# EAGLE schematic ShutdownOverview_rev0 (EAGLE 8.6.3)

## Sheet 1 of 2
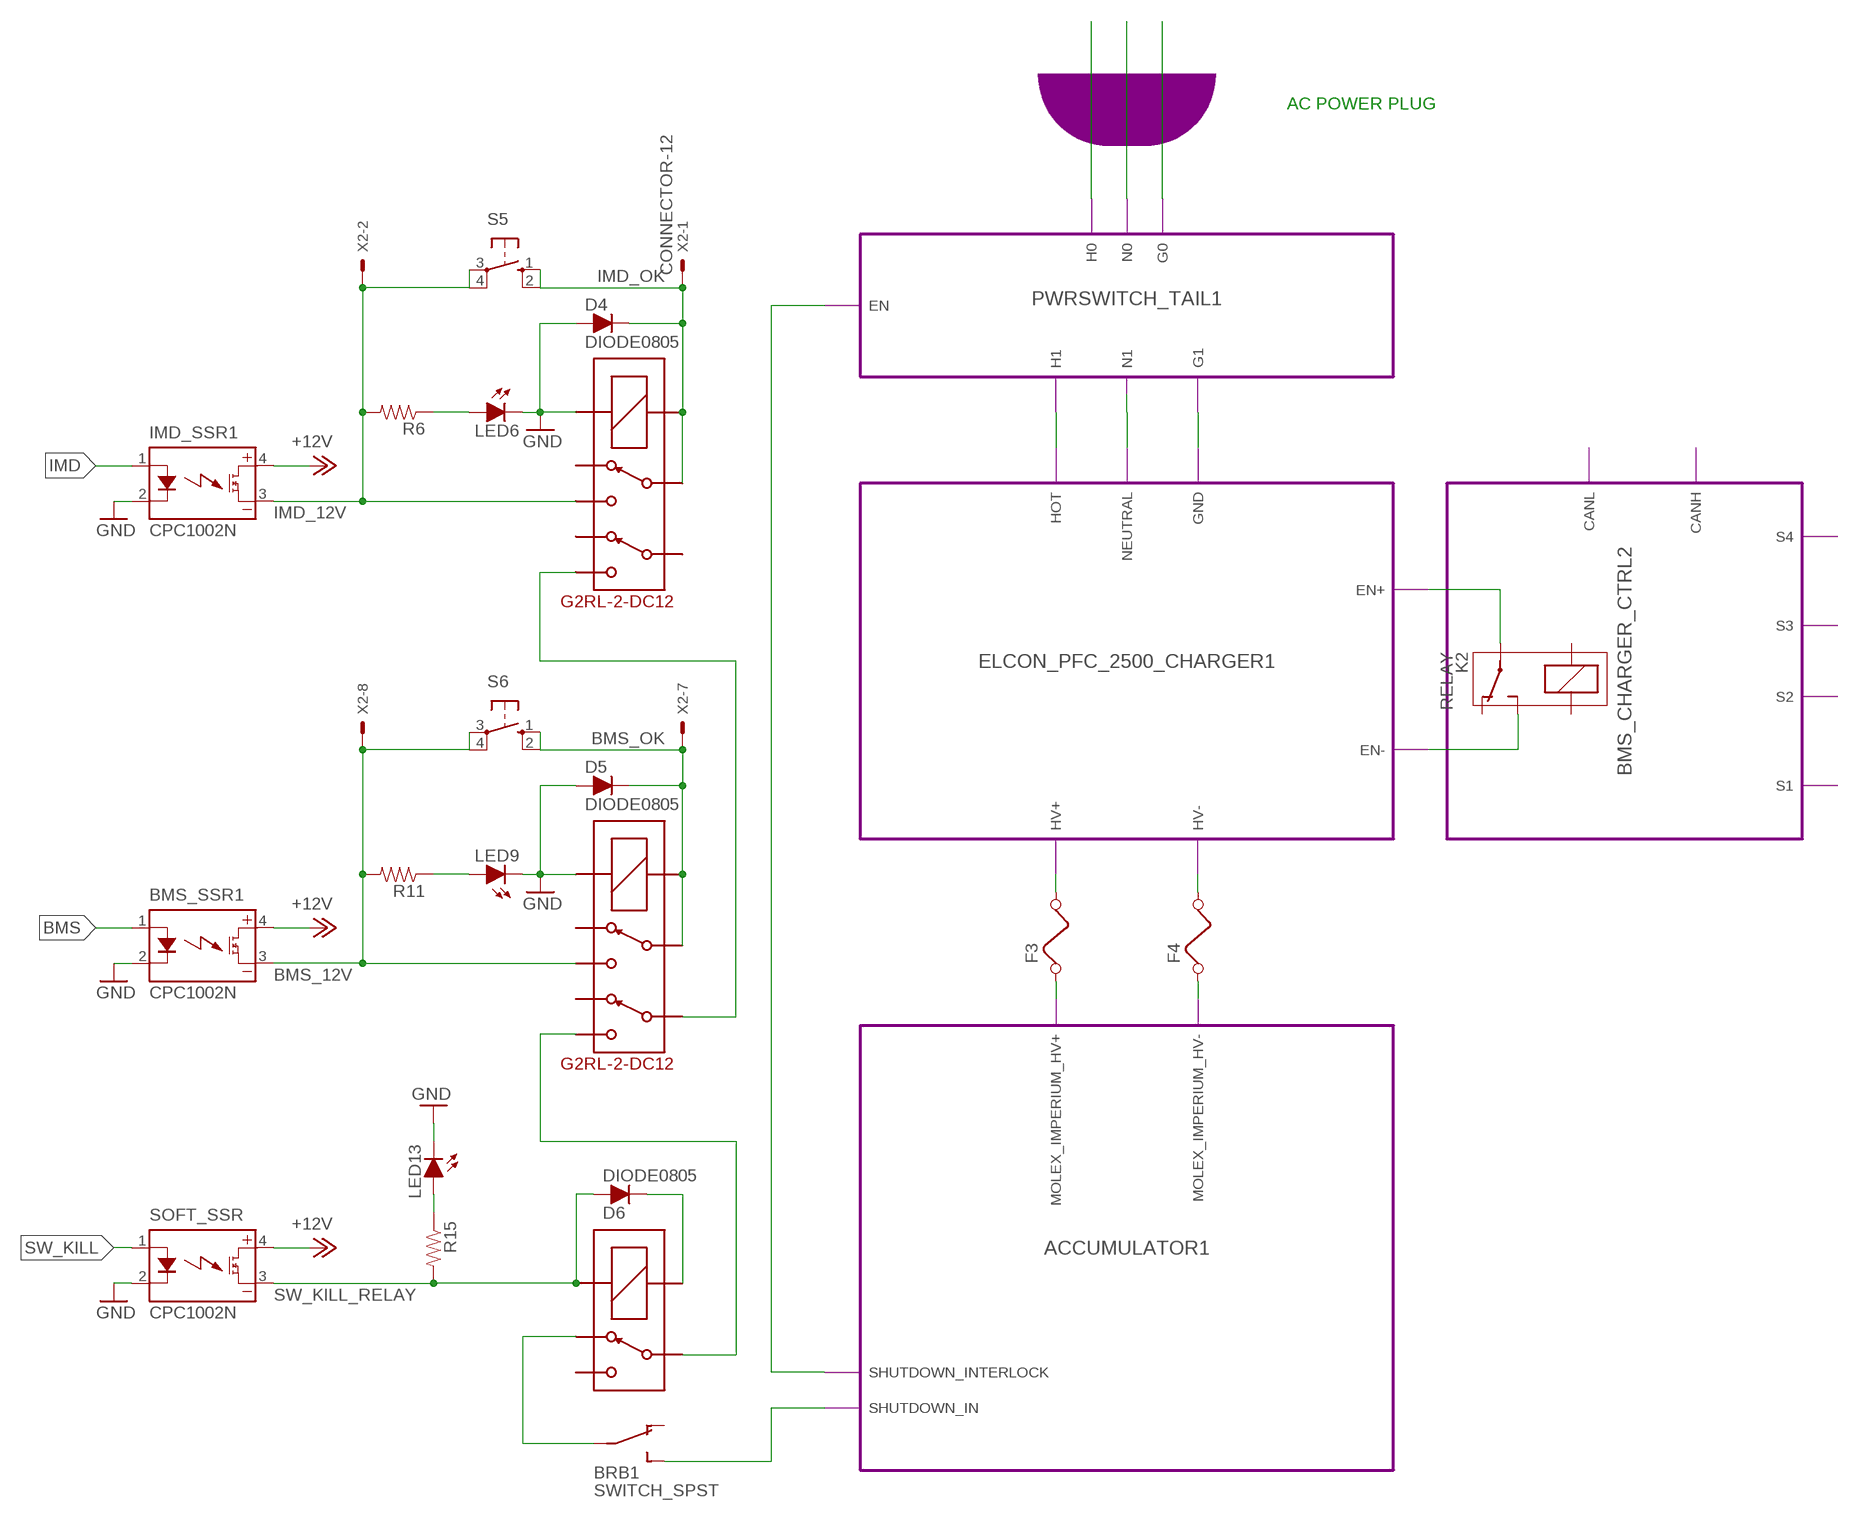
[diagram p0: schematic, sheet 1]

### Parts
BMS_SSR1  CPC1002N  [SOP04]
BRB1  SWITCH_SPST  (no package)
D4  DIODE0805  [0805_D]
D5  DIODE0805  [0805_D]
D6  DIODE0805  [0805_D]
F3  FUSE  [FUSE]
F4  FUSE  [FUSE]
IMD_SSR1  CPC1002N  [SOP04]
K2  RELAY  (no package)
LED6  LED-0805  [LED-805]
LED9  LED-0805  [LED-805]
LED13  LED-0805  [LED-805]
R6  RESISTOR0805-RES  [0805]
R11  RESISTOR0805-RES  [0805]
R15  RESISTOR0805-RES  [0805]
S5  BTN_10-XX  [B3F-10XX]
S6  BTN_10-XX  [B3F-10XX]
SOFT_SSR  CPC1002N  [SOP04]
U$6  G2RL-2-DC12  [G2RL-2]
U$7  G2RL-2-DC12  [G2RL-2]
U$8  G5LE  [ZF112]
X2  CONNECTOR-12  [MINIFIT_5566-12]

### Module instances
ACCUMULATOR1 = ACCUMULATOR
ELCON_PFC_2500_CHARGER1 = ELCON_PFC_2500_CHARGER
PWRSWITCH_TAIL1 = PWRSWITCH_TAIL
BMS_CHARGER_CTRL2 = BMS

### Nets
+12V: BMS_SSR1.4(DC+) IMD_SSR1.4(DC+) SOFT_SSR.4(DC+)
BMS: BMS_SSR1.1(CONTROL+)
BMS_12V: BMS_SSR1.3(DC-) R11.2 S6.3(P) S6.4(P1) U$7.4 X2.8
BMS_OK: D5.C S6.1(S) S6.2(S1) U$7.3 U$7.COIL- X2.7
GND: BMS_SSR1.2(CONTROL-) D4.A D5.A IMD_SSR1.2(CONTROL-) LED6.C LED9.C LED13.C SOFT_SSR.2(CONTROL-) U$6.COIL+ U$7.COIL+ ; also sheet 2
IMD: IMD_SSR1.1(CONTROL+)
IMD_12V: IMD_SSR1.3(DC-) R6.2 S5.3(P) S5.4(P1) U$6.4 X2.2
IMD_OK: D4.C S5.1(S) S5.2(S1) U$6.3 U$6.COIL- X2.1
N$1: U$6.5 U$7.6
N$2: U$7.5 U$8.P
N$3: port PWRSWITCH_TAIL1.H1 ELCON_PFC_2500_CHARGER1.HOT
N$4: port PWRSWITCH_TAIL1.N1 ELCON_PFC_2500_CHARGER1.NEUTRAL
N$5: port PWRSWITCH_TAIL1.G1 ELCON_PFC_2500_CHARGER1.GND
N$6: LED6.A R6.1
N$7: LED9.A R11.1
N$8: F3.2 ; port ELCON_PFC_2500_CHARGER1.HV+
N$9: F4.2 ; port ELCON_PFC_2500_CHARGER1.HV-
N$11: port ACCUMULATOR1.SHUTDOWN_INTERLOCK PWRSWITCH_TAIL1.EN
N$12: port PWRSWITCH_TAIL1.H0
N$13: port PWRSWITCH_TAIL1.N0
N$14: LED13.A R15.1
N$15: port PWRSWITCH_TAIL1.G0
N$19: F3.1
N$21: F4.1
N$26: K2.S ; port ELCON_PFC_2500_CHARGER1.EN-
N$27: K2.P ; port ELCON_PFC_2500_CHARGER1.EN+
N$28: BRB1.S ; port ACCUMULATOR1.SHUTDOWN_IN
N$29: D6.C U$8.2(COIL-)
N$30: U$8.O
SW_KILL: SOFT_SSR.1(CONTROL+)
SW_KILL_RELAY: D6.A R15.2 SOFT_SSR.3(DC-) U$8.1(COIL+)
Unconnected: BRB1.O BRB1.P K2.1 K2.2 K2.O U$6.2 U$6.6 U$6.7 U$7.2 U$7.7 U$8.S X2.3 X2.4 X2.5 X2.6 X2.9 X2.10 X2.11 X2.12

### Notes on the sheet
- AC POWER PLUG

## Sheet 2 of 2
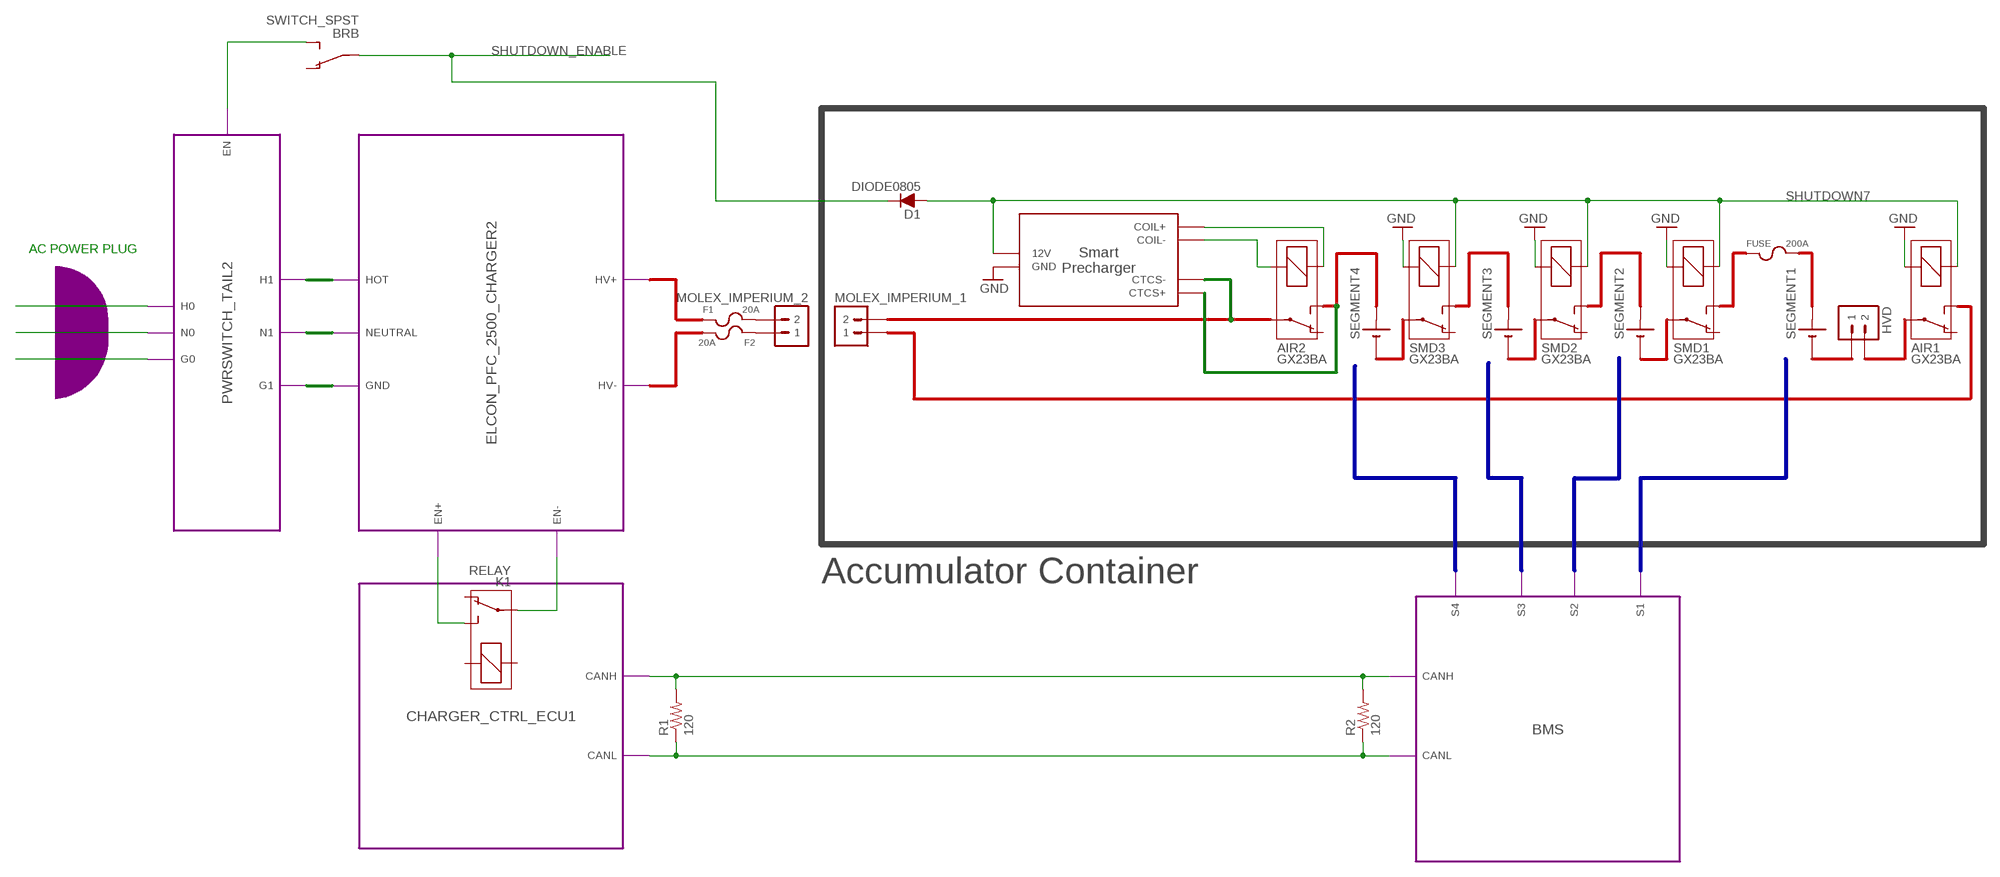
[diagram p1: schematic, sheet 2]

### Parts
AIR1  GX23BA  RELAY  (no package)
AIR2  GX23BA  RELAY  (no package)
BRB  SWITCH_SPST  (no package)
D1  DIODE0805  [0805_D]
F1  20A  FUSE  (no package)
F2  20A  FUSE  (no package)
FUSE  200A  FUSE  (no package)
HVD  M02  (no package)
K1  RELAY  (no package)
MOLEX_IMPERIUM_1  M02  (no package)
MOLEX_IMPERIUM_2  M02  (no package)
R1  120  RESISTORPTH-1/4W  [AXIAL-0.4]
R2  120  RESISTORPTH-1/4W  [AXIAL-0.4]
SEGMENT1  BATTERY_1_CELL  (no package)
SEGMENT2  BATTERY_1_CELL  (no package)
SEGMENT3  BATTERY_1_CELL  (no package)
SEGMENT4  BATTERY_1_CELL  (no package)
SMD1  GX23BA  RELAY  (no package)
SMD2  GX23BA  RELAY  (no package)
SMD3  GX23BA  RELAY  (no package)
U$3  SMART_PRECHARGER  (no package)

### Module instances
ELCON_PFC_2500_CHARGER2 = ELCON_PFC_2500_CHARGER
PWRSWITCH_TAIL2 = PWRSWITCH_TAIL
BMS = BMS
CHARGER_CTRL_ECU1 = CHARGER_CTRL_ECU

### Nets
GND: AIR1.2 SMD1.2 SMD2.2 SMD3.2 U$3.GND ; also sheet 1
N$10: BRB.S ; port PWRSWITCH_TAIL2.EN
N$16: port PWRSWITCH_TAIL2.H1 ELCON_PFC_2500_CHARGER2.HOT
N$17: port PWRSWITCH_TAIL2.N1 ELCON_PFC_2500_CHARGER2.NEUTRAL
N$18: port PWRSWITCH_TAIL2.G1 ELCON_PFC_2500_CHARGER2.GND
N$20: port PWRSWITCH_TAIL2.G0
N$22: port PWRSWITCH_TAIL2.N0
N$23: port PWRSWITCH_TAIL2.H0
N$24: K1.S ; port ELCON_PFC_2500_CHARGER2.EN+
N$25: K1.P ; port ELCON_PFC_2500_CHARGER2.EN-
N$31: F2.1 MOLEX_IMPERIUM_2.1
N$32: F1.2 MOLEX_IMPERIUM_2.2
N$37: R1.P$2 R2.P$2 ; port CHARGER_CTRL_ECU1.CANH BMS.CANH
N$38: R1.P$1 R2.P$1 ; port CHARGER_CTRL_ECU1.CANL BMS.CANL
N$42: U$3.CTCS-
N$45: AIR2.2 U$3.COIL-
N$54: AIR2.1 U$3.COIL+
N$60: U$3.CTCS+
SHUTDOWN7: AIR1.1 D1.A SMD1.1 SMD2.1 SMD3.1 U$3.12V
SHUTDOWN_ENABLE: BRB.P D1.C
Unconnected: AIR1.O AIR1.P AIR1.S AIR2.O AIR2.P AIR2.S BRB.O F1.1 F2.2 FUSE.1 FUSE.2 HVD.1 HVD.2 K1.1 K1.2 K1.O MOLEX_IMPERIUM_1.1 MOLEX_IMPERIUM_1.2 SEGMENT1.+ SEGMENT1.- SEGMENT2.+ SEGMENT2.- SEGMENT3.+ SEGMENT3.- SEGMENT4.+ SEGMENT4.- SMD1.O SMD1.P SMD1.S SMD2.O SMD2.P SMD2.S SMD3.O SMD3.P SMD3.S

### Buses
B$1
B$2
B$3
B$4

### Notes on the sheet
- AC POWER PLUG
- Accumulator Container

## Library data of the parts
AIR1 AIR2 K1 K2 SMD1-SMD3 = HyTechSymbols:RELAY: RELAY 1 x switch
BMS_SSR1 IMD_SSR1 SOFT_SSR = HyTechDevices:CPC1002N: IXYS Solid State Relay .7A
BRB BRB1 = HyTechSymbols:SWITCH_SPST: Single Pull Single Throw Switch
D1 D4-D6 = HyTechDevices:DIODE: DIODE general purpose rectifier
F1 F2 FUSE = HyTechSymbols:FUSE: Generic Fuse
F3 F4 = special:FUSE: FUSE 5 x 20 mm
HVD MOLEX_IMPERIUM_1 MOLEX_IMPERIUM_2 = HyTechSymbols:M02: Generic 2-pin connector
LED6 LED9 LED13 = HyTechDevices:LED: Light Emitting Diode (LED) Source: Dangerous Prototypes Eagle Library <https://github.com/DangerousPrototypes/Eagle_Part_Library>
R1 R2 R6 R11 R15 = HyTechDevices:RESISTOR: Resistor Basic schematic elements and footprints for 0603, 1206, and PTH resistors.
S5 S6 = HyTechDevices:BTN_10-XX: Small momentary tactile push button; MPN: B3F-1000; OC_FARNELL: 176432; OC_NEWARK: 36M3542
SEGMENT1-SEGMENT4 = HyTechSymbols:BATTERY_1_CELL: Generic 1-cell battery Source: Sonnenschein
U$3 = HyTechSymbols:SMART_PRECHARGER: Smart Precharger http://www.zeva.com.au/Products/datasheets/SmartPrechargerV1-3.pdf
U$6 U$7 = HyTechDevices:G2RL-2-DC12: Omron G2RL-2 Double Pull Double Throw Relay Coil Voltage: 12VDC (8.4-18VDC @60ºC) Contact Amperage: 8A at 30VDC Datasheet <https://www.omron.com/ecb/products/pdf/en-g2rl.pdf>
U$8 = HyTechDevices:G5LE: Omron G5LE SPST Relay 5 VDC, 12VDC, 24VDC models Coil voltage: 75% - 170% of nominal voltage Datasheet <https://www.omron.com/ecb/products/pdf/en-g5le.pdf>
X2 = HyTechDevices:CONNECTOR-12: Mini-Fit Junior connector 12 pole Source: http://www.molex.com; OC_FARNELL: unknown; OC_NEWARK: unknown

## Module ACCUMULATOR
Ports: SHUTDOWN_IN(in) SHUTDOWN_INTERLOCK(out) MOLEX_IMPERIUM_HV+(pwr) MOLEX_IMPERIUM_HV-(pwr)

### Library data of the parts

## Module ELCON_PFC_2500_CHARGER
Ports: HV+(out) HV-(out) HOT(pwr) NEUTRAL(pwr) GND(pwr) EN+(out) EN-(in)

### Library data of the parts

## Module PWRSWITCH_TAIL
Ports: H1(out) N1(out) G1(out) EN(in) H0(pwr) N0(pwr) G0(pwr)

### Library data of the parts

## Module HV_BOARD
Ports: GND(in) TSAL/TSEL_POWER(out) BSPD_CUR_FAULT(out) IMD_SUPPLY(out) IMD_GND(in) IMD_HV+(nc) IMD_HV-(nc) HV+UNFUSED(in) HV-UNFUSED(out) 12VSUPPLY(in) CANH_IN(io) CANL_IN(io) CANH_OUT(io) CANL_OUT(io) BMS_OK_OUT(out) HV+FUSED(in) HV-FUSED(out) AIR_PWR1(out) SHUTDOWN6_IN(in) SHUTDOWN6_OUT(out) SHUTDOWN7_IN(in) IMD_OKHS(in) OKHS_OUT(out) SHUTDOWN7_EXT_OUT(out) INDIC+(out) INDIC-(in) DISCHARGE+(out) DISCHARGE-(in) CUR_SENSE_RAW_2(in) TEMP_SENSE_RAW_2(in) CUR_GND_2(in) CUR_5V_2(out) EM_VCC(out) EM_GND(in) EM_IO1(io) EM_IO2(io) EM_IO1_OUT(io) EM_IO2_OUT(io) ISOSPI_P(io) ISOSPI_M(io) CUR_5V_1(out) CUR_SENSE_RAW_1(in) TEMP_SENSE_RAW_1(in) CUR_GND_1(in) DISCHARGE_RELAY_GND(out)

### Library data of the parts

## Module BMS_SEGMENT
Ports: ISOSPI1(io) ISOSPI2(io) ISOSPI3(io) ISOSPI4(io)

### Library data of the parts

## Module ENERGY_METER
Ports: HV+IN(in) HV-OUT(in) HV-IN(out) VCC(in) GND(out) IO1(io) IO2(io)

### Library data of the parts

## Module CUR_SENSE
Ports: CUR_GND(out) CUR_SENSE(out) TEMP_SENSE(out) CUR_5V(in)

### Library data of the parts

## Module BMS_SEGMENT_TEST
Ports: ISOSPI3(io) ISOSPI4(io) ISOSPI1(io) ISOSPI2(io) AMS_TEST_1(out) AMS_TEST_2(in)

### Library data of the parts

## Module BMS
Ports: S4(io) S3(io) S2(io) S1(io) CANH(io) CANL(io)

### Library data of the parts

## Module CHARGER_CTRL_ECU
Ports: CANH(io) CANL(io)

### Library data of the parts